# Altium project FAR.PrjPcb
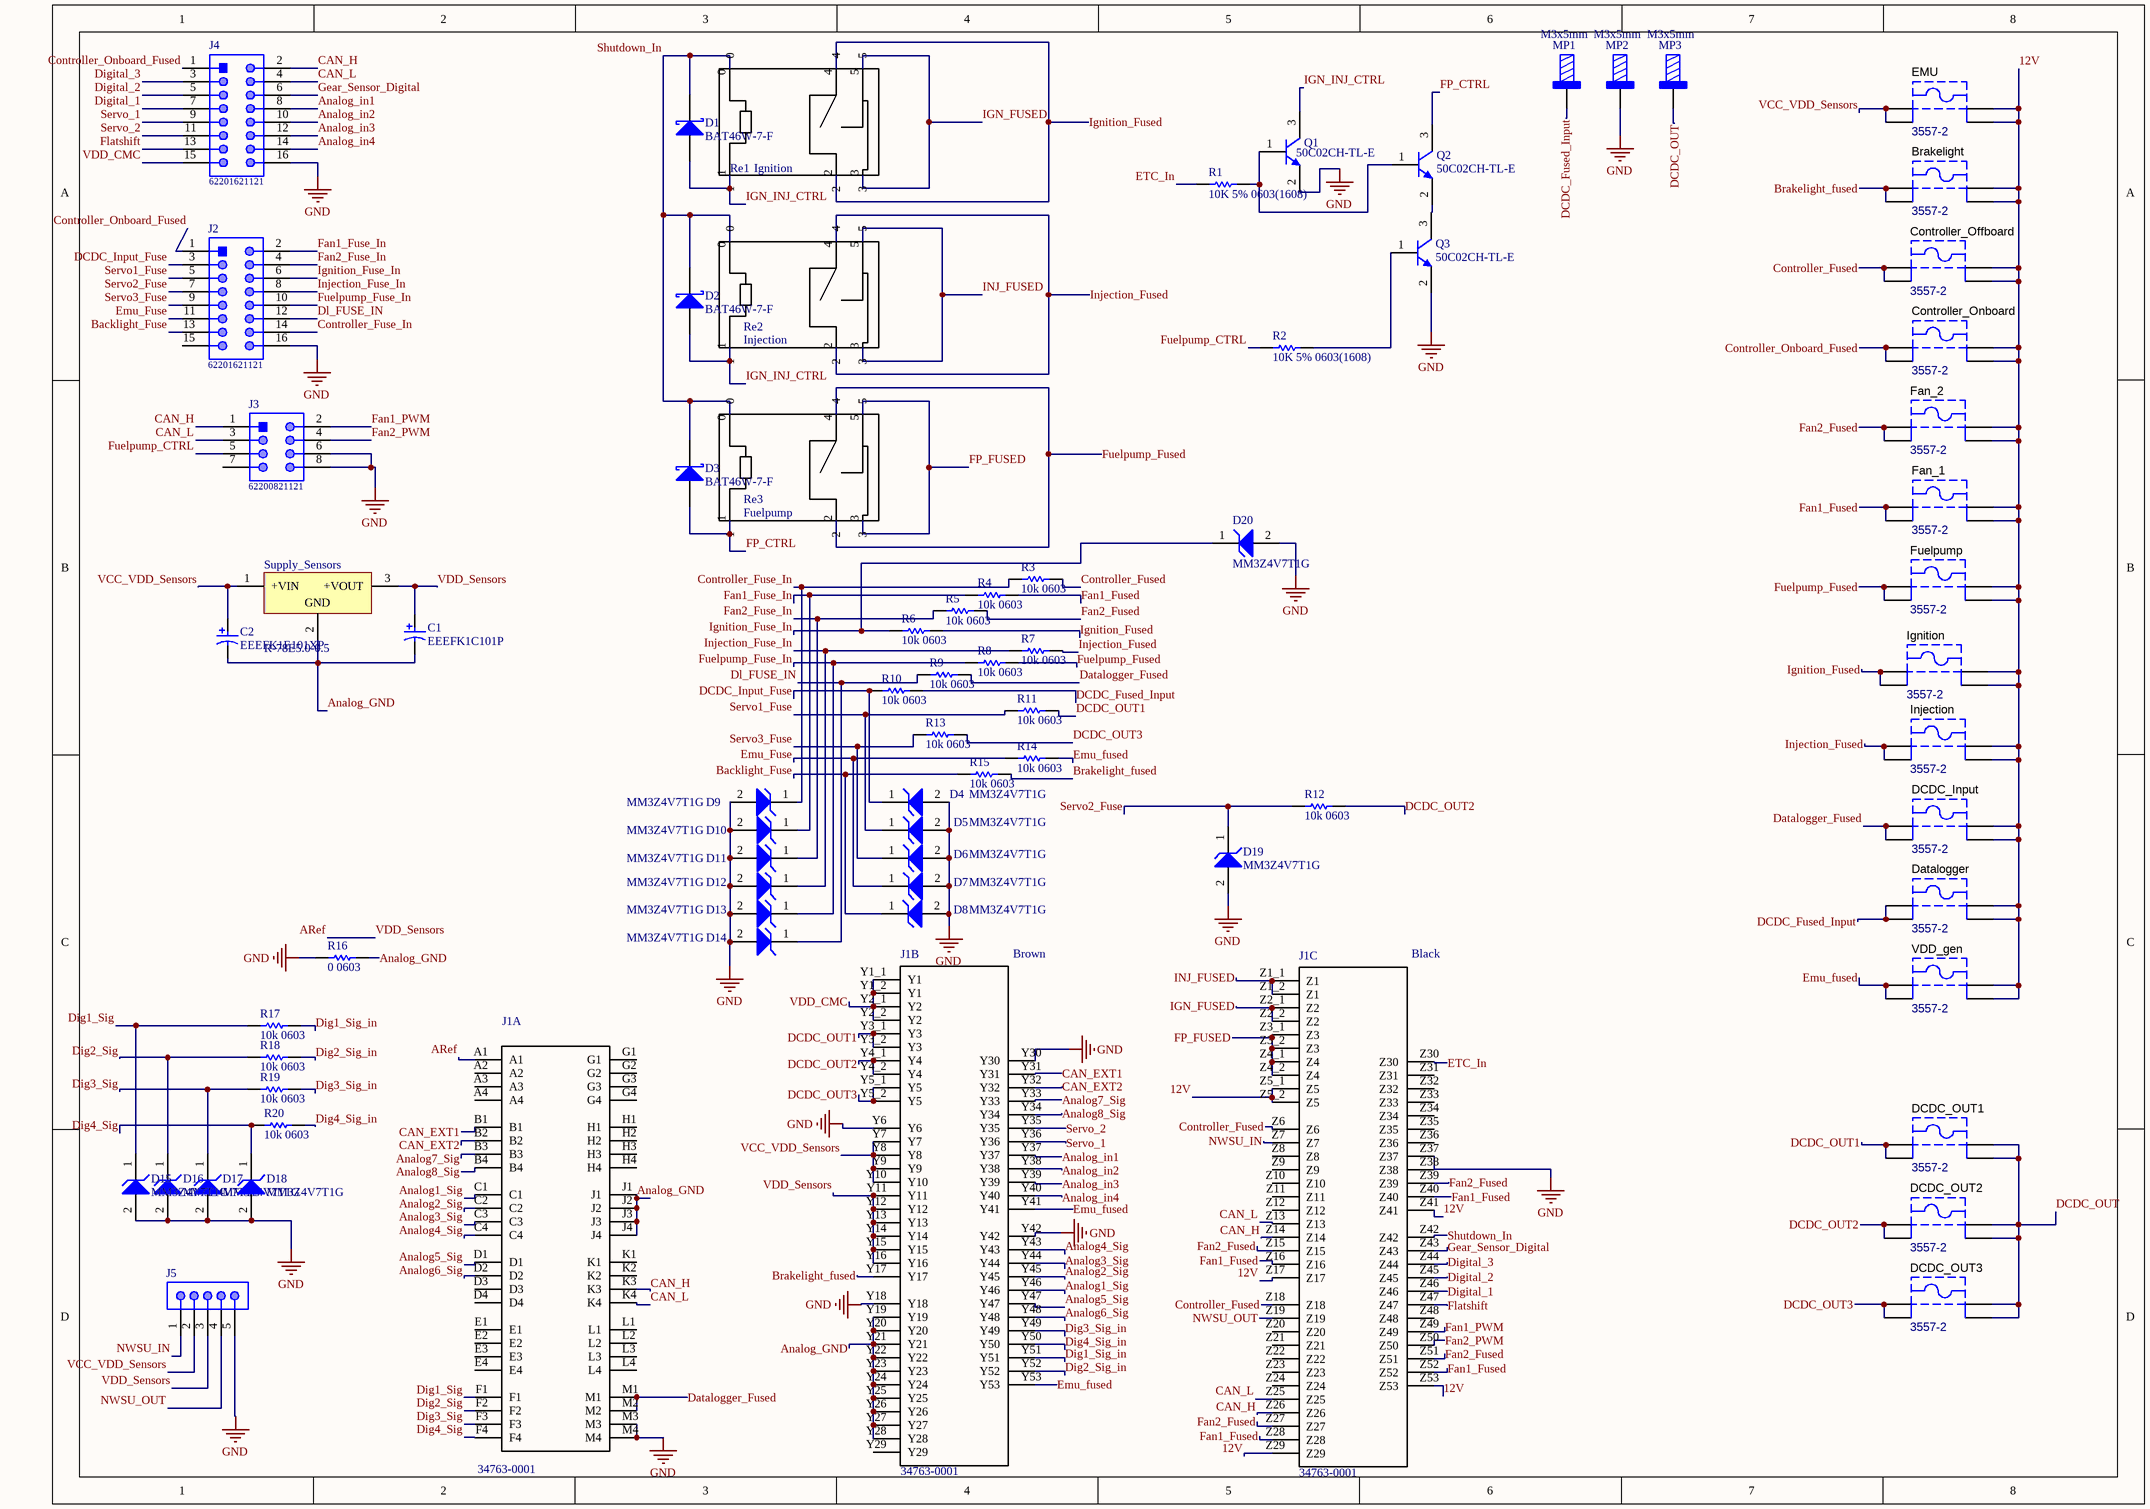
[diagram p0: FAR.SchDoc]
1 sheet, 72 parts. Net scope: global (net labels, ports and power ports of the same name join across sheets).
Board file: FAR_PCB.PcbDoc

## Sheet FAR.SchDoc
size A3

### Parts
Brakelight  3557-2  [KSTN-3557-2]
C1  EEEFK1C101P  [PNSC-EEEFK1C101P_L]
C2  EEEFK1E101XP  [PNSC-FK-V-D8_V]
Controller_Offboard  3557-2  [KSTN-3557-2]
Controller_Onboard  3557-2  [KSTN-3557-2]
D1  BAT46W-7-F  [DIOD-SOD-123-2_V]
D2  BAT46W-7-F  [DIOD-SOD-123-2_V]
D3  BAT46W-7-F  [DIOD-SOD-123-2_V]
D4  MM3Z4V7T1G  [ONSC-SOD-323-2-477-02_V]
D5  MM3Z4V7T1G  [ONSC-SOD-323-2-477-02_V]
D6  MM3Z4V7T1G  [ONSC-SOD-323-2-477-02_V]
D7  MM3Z4V7T1G  [ONSC-SOD-323-2-477-02_V]
D8  MM3Z4V7T1G  [ONSC-SOD-323-2-477-02_V]
D9  MM3Z4V7T1G  [ONSC-SOD-323-2-477-02_V]
D10  MM3Z4V7T1G  [ONSC-SOD-323-2-477-02_V]
D11  MM3Z4V7T1G  [ONSC-SOD-323-2-477-02_V]
D12  MM3Z4V7T1G  [ONSC-SOD-323-2-477-02_V]
D13  MM3Z4V7T1G  [ONSC-SOD-323-2-477-02_V]
D14  MM3Z4V7T1G  [ONSC-SOD-323-2-477-02_V]
D15  MM3Z4V7T1G  [ONSC-SOD-323-2-477-02_V]
D16  MM3Z4V7T1G  [ONSC-SOD-323-2-477-02_V]
D17  MM3Z4V7T1G  [ONSC-SOD-323-2-477-02_V]
D18  MM3Z4V7T1G  [ONSC-SOD-323-2-477-02_V]
D19  MM3Z4V7T1G  [ONSC-SOD-323-2-477-02_V]
D20  MM3Z4V7T1G  [ONSC-SOD-323-2-477-02_V]
Datalogger  3557-2  [KSTN-3557-2]
DCDC_Input  3557-2  [KSTN-3557-2]
DCDC_OUT1  3557-2  [KSTN-3557-2]
DCDC_OUT2  3557-2  [KSTN-3557-2]
DCDC_OUT3  3557-2  [KSTN-3557-2]
EMU  3557-2  [KSTN-3557-2]
Fan_1  3557-2  [KSTN-3557-2]
Fan_2  3557-2  [KSTN-3557-2]
Fuelpump  3557-2  [KSTN-3557-2]
Ignition  3557-2  [KSTN-3557-2]
Injection  3557-2  [KSTN-3557-2]
J1  34763-0001  [*MOLEX_34763-0001_34763-0001(Primary)]  (parts A,B,C of 3)
J2  62201621121  [62201621121]
J3  62200821121  [62200821121]
J4  62201621121  [62201621121]
J5  61300511121  [61300511121]  (value not drawn)
MP1  M3x5mm  [74651173]
MP2  M3x5mm  [74651173]
MP3  M3x5mm  [74651173]
Q1  50C02CH-TL-E  [ONSC-CPH-3_V]
Q2  50C02CH-TL-E  [ONSC-CPH-3_V]
Q3  50C02CH-TL-E  [ONSC-CPH-3_V]
R1  10K 5% 0603(1608)  [RESC0603(1608)_N]
R2  10K 5% 0603(1608)  [RESC0603(1608)_N]
R3  10k 0603  [RESC0603(1608)_N]
R4  10k 0603  [RESC0603(1608)_N]
R5  10k 0603  [RESC0603(1608)_N]
R6  10k 0603  [RESC0603(1608)_N]
R7  10k 0603  [RESC0603(1608)_N]
R8  10k 0603  [RESC0603(1608)_N]
R9  10k 0603  [RESC0603(1608)_N]
R10  10k 0603  [RESC0603(1608)_N]
R11  10k 0603  [RESC0603(1608)_N]
R12  10k 0603  [RESC0603(1608)_N]
R13  10k 0603  [RESC0603(1608)_N]
R14  10k 0603  [RESC0603(1608)_N]
R15  10k 0603  [RESC0603(1608)_N]
R16  0 0603  [RESC0603(1608)_N]
R17  10k 0603  [RESC0603(1608)_N]
R18  10k 0603  [RESC0603(1608)_N]
R19  10k 0603  [RESC0603(1608)_N]
R20  10k 0603  [RESC0603(1608)_N]
Re1  Ignition  [Finder 436190120300]
Re2  Injection  [Finder 436190120300]
Re3  Fuelpump  [Finder 436190120300]
Supply_Sensors  R-78E5.0-0.5  [REPO-R-78E-0.5-3_V]
VDD_gen  3557-2  [KSTN-3557-2]

### Nets
GND: D4.2(A) D5.2(A) D6.2(A) D7.2(A) D8.2(A) D9.2(A) D10.2(A) D11.2(A) D12.2(A) D13.2(A) D14.2(A) D15.2(A) D16.2(A) D17.2(A) D18.2(A) D19.2(A) D20.2(A) J1.M3 J1.M4 J1.Y6 J1.Y18 J1.Y30 J1.Y42 J1.Z37 J2.16 J3.6 J3.8 J4.16 J5.5(GND) MP2.1 Q1.2(E) Q3.2(E) R16.1
12V: Brakelight.3 Brakelight.4 Controller_Offboard.3 Controller_Offboard.4 Controller_Onboard.3 Controller_Onboard.4 Datalogger.3 Datalogger.4 DCDC_Input.3 DCDC_Input.4 EMU.3 EMU.4 Fan_1.3 Fan_1.4 Fan_2.3 Fan_2.4 Fuelpump.3 Fuelpump.4 Ignition.3 Ignition.4 Injection.3 Injection.4 J1.Z5_1(Z5) J1.Z5_2(Z5) J1.Z17 J1.Z29 J1.Z41 J1.Z53 VDD_gen.3 VDD_gen.4
Analog1_Sig: J1.C1 J1.Y46
Analog2_Sig: J1.C2 J1.Y45
Analog3_Sig: J1.C3 J1.Y44
Analog4_Sig: J1.C4 J1.Y43
Analog5_Sig: J1.D1 J1.Y47
Analog6_Sig: J1.D2 J1.Y48
Analog7_Sig: J1.B3 J1.Y33
Analog8_Sig: J1.B4 J1.Y34
Analog_GND: C1.2 C2.2 J1.J1 J1.J2 J1.J3 J1.J4 J1.Y19 J1.Y20 J1.Y21 J1.Y22 J1.Y23 J1.Y24 J1.Y25 J1.Y26 J1.Y27 J1.Y28 R16.2 Supply_Sensors.2(GND)
Analog_in1: J1.Y37 J4.8
Analog_in2: J1.Y38 J4.10
Analog_in3: J1.Y39 J4.12
Analog_in4: J1.Y40 J4.14
ARef: C1.1 J1.A1 J1.Y11 J1.Y12 J1.Y13 J1.Y14 J1.Y15 J1.Y16 J5.3(5V-In) Supply_Sensors.3(+VOUT)  [also labelled VDD_Sensors]
Backlight_Fuse: D8.1(K) J2.13 R15.1
Brakelight_fused: Brakelight.1 Brakelight.2 J1.Y17 R15.2
CAN_EXT1: J1.B1 J1.Y31
CAN_EXT2: J1.B2 J1.Y32
CAN_H: J1.K3 J1.Z14 J1.Z26 J3.1 J4.2
CAN_L: J1.K4 J1.Z13 J1.Z25 J3.3 J4.4
Controller_Fuse_In: D9.1(K) J2.14 R3.1
Controller_Fused: Controller_Offboard.1 Controller_Offboard.2 J1.Z6 J1.Z18 R3.2
Controller_Onboard_Fused: Controller_Onboard.1 Controller_Onboard.2 J2.1 J4.1
Datalogger_Fused: DCDC_Input.1 DCDC_Input.2 J1.M1 J1.M2 R9.2
DCDC_Fused_Input: Datalogger.1 Datalogger.2 MP1.1 R10.2
DCDC_Input_Fuse: D4.1(K) J2.3 R10.1
DCDC_OUT: DCDC_OUT1.3 DCDC_OUT1.4 DCDC_OUT2.3 DCDC_OUT2.4 DCDC_OUT3.3 DCDC_OUT3.4 MP3.1
DCDC_OUT1: DCDC_OUT1.1 DCDC_OUT1.2 J1.Y3_1(Y3) J1.Y3_2(Y3) R11.2
DCDC_OUT2: DCDC_OUT2.1 DCDC_OUT2.2 J1.Y4_1(Y4) J1.Y4_2(Y4) R12.2
DCDC_OUT3: DCDC_OUT3.1 DCDC_OUT3.2 J1.Y5_1(Y5) J1.Y5_2(Y5) R13.2
Dig1_Sig: D15.1(K) J1.F1 R17.1
Dig1_Sig_in: J1.Y51 R17.2
Dig2_Sig: D16.1(K) J1.F2 R18.1
Dig2_Sig_in: J1.Y52 R18.2
Dig3_Sig: D17.1(K) J1.F3 R19.1
Dig3_Sig_in: J1.Y49 R19.2
Dig4_Sig: D18.1(K) J1.F4 R20.1
Dig4_Sig_in: J1.Y50 R20.2
Digital_1: J1.Z46 J4.7
Digital_2: J1.Z45 J4.5
Digital_3: J1.Z44 J4.3
Dl_FUSE_IN: D14.1(K) J2.12 R9.1
Emu_Fuse: D7.1(K) J2.11 R14.1
Emu_fused: J1.Y41 J1.Y53 R14.2 VDD_gen.1 VDD_gen.2
ETC_In: J1.Z30 R1.1
Fan1_Fuse_In: D10.1(K) J2.2 R4.1
Fan1_Fused: Fan_1.1 Fan_1.2 J1.Z16 J1.Z28 J1.Z40 J1.Z52 R4.2
Fan1_PWM: J1.Z49 J3.2
Fan2_Fuse_In: D11.1(K) J2.4 R5.1
Fan2_Fused: Fan_2.1 Fan_2.2 J1.Z15 J1.Z27 J1.Z39 J1.Z51 R5.2
Fan2_PWM: J1.Z50 J3.4
Flatshift: J1.Z47 J4.13
FP_CTRL: D3.1(A) Q2.3(C) Re3.1
FP_FUSED: J1.Z3_1(Z3) J1.Z3_2(Z3) J1.Z4_1(Z4) J1.Z4_2(Z4) Re3.3 Re3.5
Fuelpump_CTRL: J3.5 R2.1
Fuelpump_Fuse_In: D13.1(K) J2.10 R8.1
Fuelpump_Fused: Fuelpump.1 Fuelpump.2 R8.2 Re3.2 Re3.4
Gear_Sensor_Digital: J1.Z43 J4.6
IGN_FUSED: J1.Z2_1(Z2) J1.Z2_2(Z2) Re1.3 Re1.5
IGN_INJ_CTRL: D1.1(A) D2.1(A) Q1.3(C) Re1.1 Re2.1
Ignition_Fuse_In: D20.1(K) J2.6 R6.1
Ignition_Fused: Ignition.1 Ignition.2 R6.2 Re1.2 Re1.4
INJ_FUSED: J1.Z1_1(Z1) J1.Z1_2(Z1) Re2.3 Re2.5
Injection_Fuse_In: D12.1(K) J2.8 R7.1
Injection_Fused: Injection.1 Injection.2 R7.2 Re2.2 Re2.4
NWSU_IN: J1.Z7 J5.1(S-In)
NWSU_OUT: J1.Z19 J5.4(S-Out)
Servo1_Fuse: D5.1(K) J2.5 R11.1
Servo2_Fuse: D19.1(K) J2.7 R12.1
Servo3_Fuse: D6.1(K) J2.9 R13.1
Servo_1: J1.Y36 J4.9
Servo_2: J1.Y35 J4.11
Shutdown_In: D1.2(K) D2.2(K) D3.2(K) J1.Z42 Re1.0 Re2.0 Re3.0
VCC_VDD_Sensors: C2.1 EMU.1 EMU.2 J1.Y7 J1.Y8 J1.Y9 J1.Y10 J5.2(12V-In) Supply_Sensors.1(+VIN)
VDD_CMC: J1.Y1_1(Y1) J1.Y1_2(Y1) J1.Y2_1(Y2) J1.Y2_2(Y2) J4.15
NetQ1_1: Q1.1(B) Q2.1(B) R1.2
NetQ2_2: Q2.2(E) Q3.3(C)
NetQ3_1: Q3.1(B) R2.2

Not connected (* = marked no-connect by the designer): J1 A2 A3 A4 D3 D4 E1 E2 E3 E4 G1 G2 G3 G4 H1 H2 H3 H4 K1 K2 L1 L2 L3 L4 Y29 Z8 Z9 Z10 Z11 Z12 Z20 Z21 Z22 Z23 Z24 Z31 Z32 Z33 Z34 Z35 Z36 Z38 Z48; J2 15; J3 7

### Notes on the sheet
- (near J1) Brown
- (near J1) Black

### Library data of the parts
Brakelight Controller_Offboard Controller_Onboard Datalogger DCDC_Input DCDC_OUT1-DCDC_OUT3 EMU Fan_1 Fan_2 Fuelpump Ignition Injection VDD_gen = CMP-2000-05461-1: FUSE HOLDER, PCB MOUNT, 500VAC, 20A, ROHS; Manufacturer: Keystone-Electronics; Number of Circuits: 1; Voltage: 500V; Fuseholder Type: Block; Fuse Type: Blade; Fuse Size: 0.43"Lx0.15"Wx0.64"H(10.92mmx3.81mmx16.25mm); For Use With/Related Products: ATC,ATO257,MINI897; Current Rating: 30A; Datasheet URL: http://datasheet.octopart.com/3557-2-Keystone-datasheet-15715937.pdf; Orientation: Vertical; Family: Fuseholders; Datasheet Version: Apr-13; Contact Finish: TinNickel; Mounting Type: PCB; Series: -; Category: CircuitProtection; Termination Style: PCPin; Contact Material: Brass; Manufacturer URL: http://www.keyelco.com/
C1 = CMP-2000-06203-1: Aluminum Electrolytic Capacitor, 100 uF, 20%, 16 V, -55 to 105 degC, 2-Pin SMD, RoHS, Tape and Reel; Manufacturer: Panasonic; Lifetime@Temperature: 2000Hrs@105°C; Impedance: 0.36O; Ripple Current: 240mA; Rated Voltage: 16V; Type: Can; Capacitance: 100µF; Datasheet URL: http://datasheet.octopart.com/EEEFK1C101P-Panasonic-datasheet-13266987.pdf; Package Description: 2-Pin Surface Mount Device, Body 6.6 x 6.6 mm; Manufacturer URL: http://www.panasonic.com/; Case Size/Dimension: Ø6.3x5.8mm; Series: FK; Datasheet Version: 11/2012; Mounting Technology: SurfaceMount; Package Reference: EEEFK1C101P; Operating Temp-Max: 105°C; Operating Temp Range: -55to+105°C
C2 = CMP-2000-06206-1: Aluminum Electrolytic Capacitor, 100 uF, +/- 20%, 25 V, 2-Pin SMD (Size Code D8), -55 to 105 degC, RoHS, Tape and Reel; Manufacturer: Panasonic; Type: Can; Lifetime@Temperature: 2000Hrs@105°C; Capacitance: 100µF; Rated Voltage: 25V; Ripple Current: 280mA; Impedance: 0.34O; Case Size/Dimension: Ø6.3x7.7mm; Operating Temp-Max: 105°C; Series: FK; Package URL: http://industrial.panasonic.com/cdbs/www-data/pdf/RDE0000/DME0000COL48.pdf; Mounting Technology: SurfaceMount; Package Description: 2-Pin Electrolytic Aluminum Capacitor, Body 6.6 x 6.6 mm; Datasheet Version: 03/2016; Datasheet URL: http://industrial.panasonic.com/cdbs/www-data/pdf/RDE0000/ABA0000C1181.pdf; Manufacturer URL: http://www.panasonic.com/; Package Reference: FK-V-D8; Operating Temp Range: -55to+105°C
D1-D3 = CMP-0303-00004-1: Surface Mount Schottky Barrier Diode, 100 V, -55 to 125 degC, 2-Pin SOD123, RoHS, Tape and Reel; Manufacturer: Diodes Inc; IR@1.5 V: 0.3 uA Max.; V(BR)R: 100 V Min.; VF@10 mA: 0.45 V Max.; CT@1 V: 12 pF Typ.; PartNumber: BAT46W-7-F; ComponentLink1URL: http://www.diodes.com/; ComponentLink3URL: http://diodes.com/datasheets/ds30044.pdf; PackageDescription: 2-Pin SMD, Body 2.7 x 1.55 mm, Height 1.45 mm; ComponentLink2Description: Datasheet; ComponentLink3Description: Package Specification; Mounting Technology: Surface Mount; ComponentLink1Description: Manufacturer URL; RoHS: TRUE; Operating Temperature: -55 to 125 degC; Packing: Tape and Reel; ComponentLink2URL: http://diodes.com/datasheets/ds30044.pdf; DatasheetVersion: Rev. 16-2
D4-D20 = CMP-1060-00657-1: Zener Voltage Regulator, 300 mW, 2-Pin SOD-323, Pb-Free, Tape and Reel; Manufacturer: On Semiconductor; VZ Typ (V): 4.7; P Max (W): 0.3; ComponentLink1Description: Manufacturer URL; PackageVersion: Rev. H, 03/2007; RoHS: Pb-Free; PackageReference: SOD-323-2-477-02; DatasheetVersion: Rev. 9; ComponentLink1URL: http://www.onsemi.com/; ComponentLink2Description: Datasheet; PartNumber: MM3Z4V7T1G; Mounting Technology: Surface Mount; ComponentLink2URL: http://www.onsemi.cn/pub_link/Collateral/MM3Z2V4T1-D.PDF; PackageDescription: 2-Pin SOD, Body 1.7 x 1.25 mm; Packing: Tape and Reel; ComponentLink3Description: Package Specification; ComponentLink3URL: http://www.onsemi.com/pub_link/Collateral/477-02.PDF.1
J1 = 34763-0001: Automotive Connectors CMC HDR ASSY 154 WAY JD MECA 48-53-53; MF: Molex; Availability: Unavailable; SnapEDA_Link: https://www.snapeda.com/parts/34763-0001/Molex/view-part/?ref=snap; Package: None; MP: 34763-0001; Price: None; Value: *
J2 J4 = CMP-1502-00950-1: THT Vertical Pin Header WR-PHD, Pitch 1.27 mm, Dual Row, 16 pins; Manufacturer: Wurth Elektronik; Gender: Male; Working Voltage: 100VAC; Rated Current: 1A; Pin Number: 16; Pitch: 1.27mm; Contact Resistance: 20mOhm; Withstanding Voltage: 500VAC; Publisher: WurthElektronik; Package Reference: 62201621121; Part Number: 62201621121; Packaging: Box; Row Number: Dual; Mounting Technology: THT; Operating Temperature: -40to105degC; Manufacturer URL: http://www.we-online.de; Orientation: Vertical; Datasheet URL: https://katalog.we-online.de/em/datasheet/62201621121.pdf
J3 = CMP-1502-00947-1: THT Vertical Pin Header WR-PHD, Pitch 1.27 mm, Dual Row, 8 pins; Manufacturer: Wurth Elektronik; Contact Resistance: 20mOhm; Pin Number: 8; Rated Current: 1A; Gender: Male; Working Voltage: 100VAC; Withstanding Voltage: 500VAC; Pitch: 1.27mm; Package Reference: 62200821121; Publisher: WurthElektronik; Packaging: Box; Operating Temperature: -40to105degC; Manufacturer URL: http://www.we-online.de; Row Number: Dual; Mounting Technology: THT; Part Number: 62200821121; Orientation: Vertical; Datasheet URL: https://katalog.we-online.de/em/datasheet/62200821121.pdf
J5 = 61300511121: WR-PHD Pin Header, THT, pitch 2.54mm, Single Row, Vertical, 5pin; Pin Number: 5; Gender: Male; Rated Current: 3A; Working Voltage: 250VAC; Withstanding Voltage: 500VAC; Contact Resistance: 20mOhm; ComponentLink1Description: Manufacturer; ComponentLink1URL: http://www.we-online.de; ComponentLink2Description: Datasheet; ComponentLink2URL: https://katalog.we-online.de/em/datasheet/6130xx11121.pdf; Part Number: 61300511121; Published Date: June 2019; Publisher: Wurth Elektronik; Pitch: 2.54mm; Operating Temperature: -40 to +105degC; Mounting Technology: THT; Packaging: Bag; Row Number: Single; Orientation: Vertical
MP1-MP3 = 74651173: WP-THRSH REDCUBE THR with external thread, 7x7mm, M3x5mm, 4 pins, 50A; Pin Number: 4; Thread: M3; Surface: Tin; Thread Length: 5mm; ComponentLink1Description: Manufacturer; ComponentLink1URL: http://www.we-online.de; ComponentLink2Description: Datasheet; ComponentLink2URL: https://katalog.we-online.com/em/datasheet/74651173.pdf; Operating Temperature: -55 to +150degC; Height: 8.5mm; Material: Brass; Part Number: 74651173; Packaging: Bulk; Mounting Technology: SMT; Rated Current: 50A; Publisher: Wurth Elektronik; Published Date: September 2019; Size: 7x7mm
Q1-Q3 = CMP-1048-00075-1: Bipolar Transistor, 50 V, 0.5 A, Low VCE(sat), NPN Single, 3-Pin CPH, Pb-Free, Tape and Reel; Manufacturer: On Semiconductor; IC Continuous (A): 0.5; Polarity: NPN; ComponentLink2Description: Datasheet; ComponentLink1URL: http://www.onsemi.com/; PartNumber: 50C02CH-TL-E; ComponentLink1Description: Manufacturer URL; PackageReference: CPH-3; Mounting Technology: Surface Mount; ComponentLink2URL: http://www.onsemi.com/pub_link/Collateral/50C02CH-D.PDF; PackageDescription: 3-Pin Small Outline Transistor, Body 2.9 x 1.6 mm, Pitch 0.95 mm; ComponentLink3Description: Package Specification; ComponentLink3URL: http://www.onsemi.com/pub_link/Collateral/50A02CH-D.PDF; Packing: Tape and Reel; RoHS: TRUE
R1-R20 = CMP-1012-00098-1: 10K 0.1W 5% 0603 (1608 Metric)  SMD; Case-EIA: 0603; Value: 10000.00 Ohm; Case-Metric: 1608; Technology: SMT; Tolerance: 5 %; Power: 0.1 W
Re1-Re3 = Finder 4361-0300: 1 Schließer, 16A; pin to pad: 0>1 1>2 2>3 3>4 4>5 5>6
Supply_Sensors = CMP-2000-06922-2: DC/DC-Converter, 5 V Single Output, 500 mA, -40 to 85 degC, 3-Pin THD, RoHS, Tube; Manufacturer: Recom Power; Efficiency: 92%; Number of Outputs: 1; Current - Output (Max): 500mA; VIN Min: 7V; Package Version: Rev. 0; VIN Max: 28V; VOUT: 5V; Manufacturer URL: http://www.recom-power.com/us/americas/home.html; Operating Temperature: -40°C~85°C; Datasheet Version: 01/2017; Packaging: Tube; Package Reference: SIP Module; Datasheet URL: http://www.recom-power.com/pdf/Innoline/R-78Exx-0.5.pdf; Package Description: 3-Pin Through Hole Device, Body 11.6 x 8.5 mm, Pitch 2.54 mm; Mounting Technology: ThroughHole